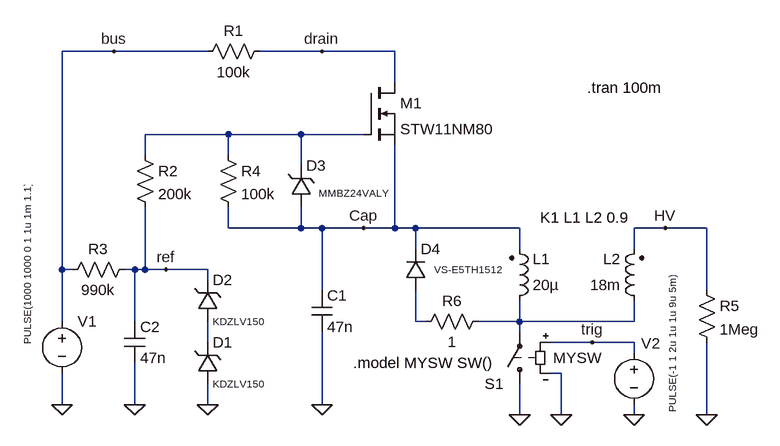
[diagram p0: schematic Pulse_gen_tr_model.asc]
Pulse_gen_tr_model.asc, the LTspice schematic file:
Version 4
SHEET 1 1696 680
WIRE 432 -336 352 -336
WIRE 576 -336 432 -336
WIRE 752 -336 656 -336
WIRE 864 -336 752 -336
WIRE 864 -288 864 -336
WIRE 608 -208 480 -208
WIRE 720 -208 608 -208
WIRE 816 -208 720 -208
WIRE 480 -176 480 -208
WIRE 608 -176 608 -208
WIRE 720 -160 720 -208
WIRE 608 -64 608 -96
WIRE 720 -64 720 -96
WIRE 720 -64 608 -64
WIRE 752 -64 720 -64
WIRE 816 -64 752 -64
WIRE 864 -64 864 -192
WIRE 864 -64 816 -64
WIRE 896 -64 864 -64
WIRE 1056 -64 896 -64
WIRE 1280 -64 1232 -64
WIRE 1344 -64 1280 -64
WIRE 896 -32 896 -64
WIRE 1056 -32 1056 -64
WIRE 1232 -32 1232 -64
WIRE 352 0 352 -336
WIRE 368 0 352 0
WIRE 464 0 448 0
WIRE 480 0 480 -96
WIRE 480 0 464 0
WIRE 512 0 480 0
WIRE 576 0 512 0
WIRE 576 16 576 0
WIRE 752 32 752 -64
WIRE 1344 32 1344 -64
WIRE 352 80 352 0
WIRE 464 80 464 0
WIRE 896 80 896 32
WIRE 912 80 896 80
WIRE 1056 80 1056 48
WIRE 1056 80 992 80
WIRE 1232 80 1232 48
WIRE 1232 80 1056 80
WIRE 1056 96 1056 80
WIRE 576 112 576 80
WIRE 1168 112 1104 112
WIRE 1232 112 1168 112
WIRE 1232 128 1232 112
WIRE 1120 160 1104 160
WIRE 352 208 352 160
WIRE 464 208 464 144
WIRE 576 208 576 176
WIRE 752 208 752 96
WIRE 1056 224 1056 176
WIRE 1120 224 1120 160
WIRE 1232 224 1232 208
WIRE 1344 224 1344 112
FLAG 352 208 0
FLAG 752 208 0
FLAG 816 -64 Cap
FLAG 576 208 0
FLAG 752 -336 drain
FLAG 432 -336 bus
FLAG 464 208 0
FLAG 512 0 ref
FLAG 1280 -64 HV
FLAG 1168 112 trig
FLAG 1056 224 0
FLAG 1120 224 0
FLAG 1232 224 0
FLAG 1344 224 0
SYMBOL voltage 352 64 R0
WINDOW 123 0 0 Left 0
WINDOW 39 0 0 Left 0
WINDOW 3 -53 -191 VRight 1
SYMATTR Value PULSE(1000 1000 0 1 1u 1m 1.1)
SYMATTR InstName V1
SYMBOL res 560 -320 R270
WINDOW 0 32 56 VTop 2
WINDOW 3 0 56 VBottom 2
SYMATTR InstName R1
SYMATTR Value 100k
SYMBOL cap 736 32 R0
SYMATTR InstName C1
SYMATTR Value 47n
SYMBOL sw 1056 192 R180
WINDOW 3 -126 56 Left 2
SYMATTR Value MYSW
SYMATTR InstName S1
SYMBOL voltage 1232 112 R0
WINDOW 123 0 0 Left 0
WINDOW 39 0 0 Left 0
WINDOW 3 59 -100 VRight 1
WINDOW 0 11 2 Left 2
SYMATTR Value PULSE(-1 1 2u 1u 1u 9u 5m)
SYMATTR InstName V2
SYMBOL nmos 816 -288 R0
SYMATTR InstName M1
SYMATTR Value STW11NM80
SYMBOL zener 560 176 M180
WINDOW 0 24 64 Left 2
WINDOW 3 24 0 Left 1
SYMATTR InstName D1
SYMATTR Value KDZLV150
SYMATTR Description Diode
SYMATTR Type diode
SYMBOL zener 560 80 M180
WINDOW 0 24 64 Left 2
WINDOW 3 24 0 Left 1
SYMATTR InstName D2
SYMATTR Value KDZLV150
SYMATTR Description Diode
SYMATTR Type diode
SYMBOL cap 448 80 R0
SYMATTR InstName C2
SYMATTR Value 47n
SYMBOL res 464 -192 R0
SYMATTR InstName R2
SYMATTR Value 200k
SYMBOL zener 704 -96 M180
WINDOW 0 24 64 Left 2
WINDOW 3 43 22 Left 1
SYMATTR InstName D3
SYMATTR Value MMBZ24VALY
SYMATTR Description Diode
SYMATTR Type diode
SYMBOL res 464 -16 R90
WINDOW 0 0 56 VBottom 2
WINDOW 3 32 56 VTop 2
SYMATTR InstName R3
SYMATTR Value 990k
SYMBOL res 592 -192 R0
SYMATTR InstName R4
SYMATTR Value 100k
SYMBOL ind2 1040 64 M180
WINDOW 0 36 80 Left 2
WINDOW 3 36 40 Left 2
SYMATTR InstName L1
SYMATTR Value 20µ
SYMATTR Type ind
SYMATTR SpiceLine Rser=0.32
SYMBOL ind2 1248 64 R180
WINDOW 0 36 80 Left 2
WINDOW 3 36 40 Left 2
SYMATTR InstName L2
SYMATTR Value 18m
SYMATTR Type ind
SYMATTR SpiceLine Rser=220
SYMBOL res 1328 16 R0
SYMATTR InstName R5
SYMATTR Value 1Meg
SYMBOL diode 880 32 M180
WINDOW 0 24 64 Left 2
WINDOW 3 45 32 Left 1
SYMATTR InstName D4
SYMATTR Value VS-E5TH1512
SYMBOL res 1008 64 R90
WINDOW 0 0 56 VBottom 2
WINDOW 3 32 56 VTop 2
SYMATTR InstName R6
SYMATTR Value 1
TEXT 800 144 Left 2 !.model MYSW SW()
TEXT 1160 -280 Left 2 !.tran 100m
TEXT 1088 -80 Left 2 !K1 L1 L2 0.9

The netlist it stands for:
* Pulse_gen_tr_model.asc
V1 bus 0 PULSE(1000 1000 0 1 1u 1m 1.1)
R1 bus drain 100k
C1 Cap 0 47n
S1 0 N003 trig 0 MYSW
V2 trig 0 PULSE(-1 1 2u 1u 1u 9u 5m)
M1 drain N001 Cap Cap STW11NM80
D1 0 N004 KDZLV150
D2 N004 ref KDZLV150
C2 ref 0 47n
R2 N001 ref 200k
D3 Cap N001 MMBZ24VALY
R3 ref bus 990k
R4 N001 Cap 100k
L1 N003 Cap 20µ Rser=0.32
L2 N003 HV 18m Rser=220
R5 HV 0 1Meg
D4 N002 Cap VS-E5TH1512
R6 N003 N002 1
.model D D
.lib standard.dio
.model NMOS NMOS
.model PMOS PMOS
.lib standard.mos
.model MYSW SW()
.tran 100m
K1 L1 L2 0.9
.backanno
.end